# EAGLE design MyPulseSensorTH (EAGLE 6.5.0)
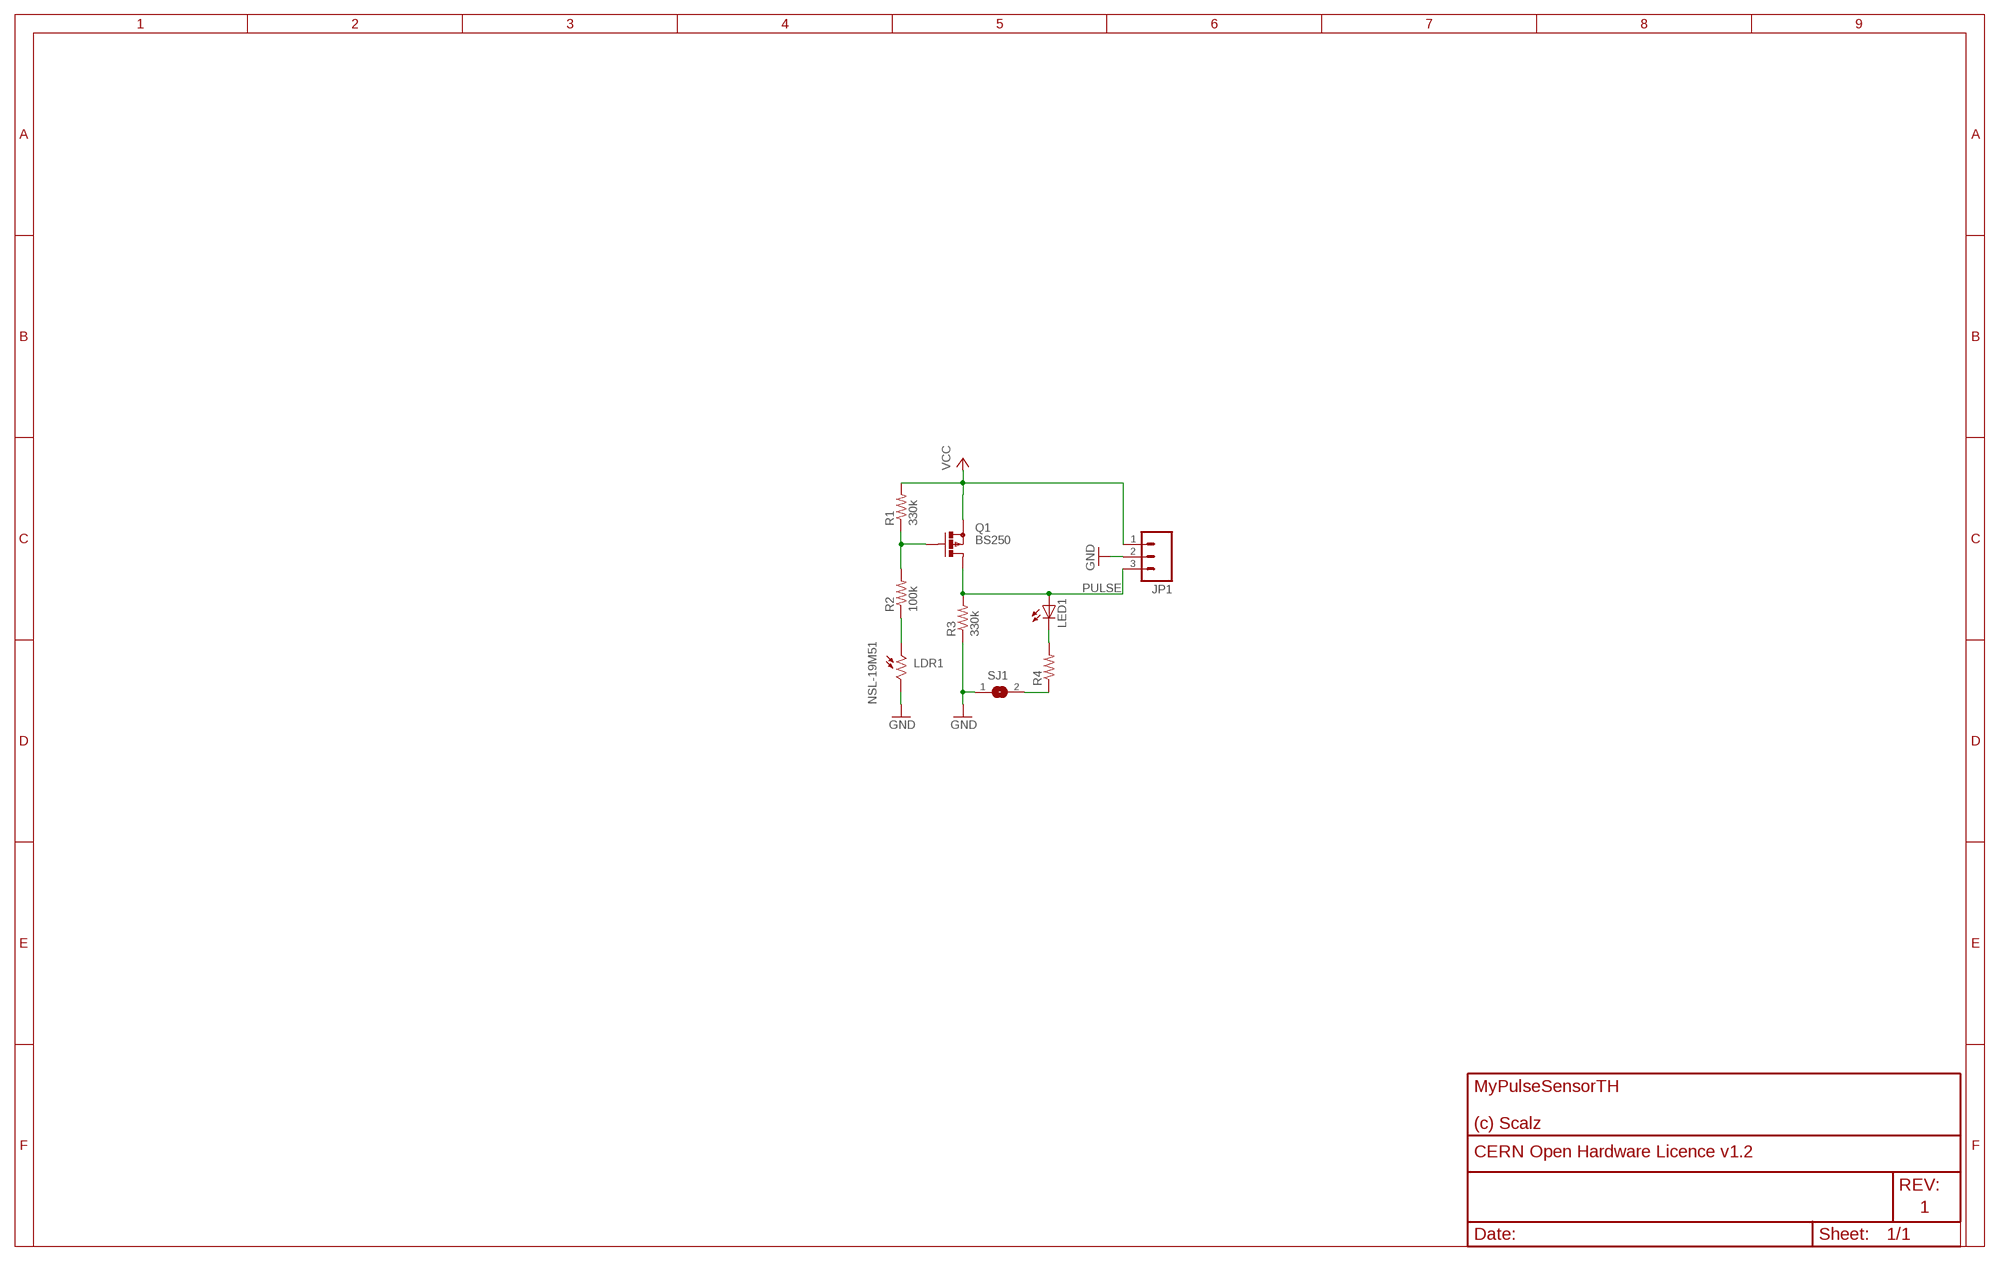
[diagram p0: schematic, sheet 1]

## Parts
JP1  M03PTH  [1X03]
LDR1  NSL-19M51  [PHOTORESISTOR_TO18]
LED1  LED5MM  [LED5MM]
Q1  BS250  [SOT54E]
R1  330k  RESISTOR  [RESISTOR_TH]
R2  100k  RESISTOR  [RESISTOR_TH]
R3  330k  RESISTOR  [RESISTOR_TH]
R4  RESISTOR  [RESISTOR_TH]
SJ1  SJ  [SJ]

## Nets
GND: JP1.2 LDR1.2 R3.1 SJ1.1
N$1: Q1.G R1.1 R2.2
N$2: LDR1.1 R2.1
N$3: LED1.K(C) R4.2
N$4: R4.1 SJ1.2
PULSE: JP1.3 LED1.A Q1.D R3.2
VCC: JP1.1 Q1.S R1.2

## Library data of the parts
JP1 = SparkFun-Connectors:M03: Header 3 Standard 3-pin 0.1" header. Use with straight break away headers (SKU : PRT-00116), right angle break away headers (PRT-00553), swiss pins (PRT-00743), machine pins (PRT-00117), and female headers (PRT-00115). Molex polarized connector foot print use with SKU : PRT-08232 with associated crimp pins and housings.
LDR1 = pulsesensor:NSL-19M51
LED1 = adafruit:LED: LED OSRAM: - CHIPLED LG R971, LG N971, LY N971, LG Q971, LY Q971, LO R971, LY R971 LH N974, LH R974 LS Q976, LO Q976, LY Q976 LO Q996 - Hyper CHIPLED LW Q18S LB Q993, LB Q99A, LB R99A - SideLED LS A670, LO A670, LY A670, LG A670, LP A670 LB A673, LV A673, LT A673, LW A673 LH A674 LY A675 LS A676, LA A676, LO A676, LY A676, LW A676 LS A679, LY A679, LG A679 - Hyper Micro SIDELED® LS Y876, LA Y876, LO Y876, LY Y876 LT Y87S - SmartLED LW L88C, LW L88S LB L89C, LB L89S, LG L890 LS L89K, LO L89K, LY L89K LS L896, LA L896, LO L896, LY L896 - TOPLED LS T670, LO T670, LY T670, LG T670, LP T670 LSG T670, LSP T670, LSY T670, LOP T670, LYG T670 LG T671, LOG T671, LSG T671 LB T673, LV T673, LT T673, LW T673 LH T674 LS T676, LA T676, LO T676, LY T676, LB T676, LH T676, LSB T676, LW T676 LB T67C, LV T67C, LT T67C, LS T67K, LO T67K, LY T67K, LW E67C LS E67B, LA E67B, LO E67B, LY E67B, LB E67C, LV E67C, LT E67C LW T67C LS T679, LY T679, LG T679 LS T770, LO T770, LY T770, LG T770, LP T770 LB T773, LV T773, LT T773, LW T773 LH T774 LS E675, LA E675, LY E675, LS T675 LS T776, LA T776, LO T776, LY T776, LB T776 LHGB T686 LT T68C, LB T68C - Hyper Mini TOPLED® LB M676 - Mini TOPLED Santana® LG M470 LS M47K, LO M47K, LY M47K Source: http://www.osram.convergy.de/
Q1 = transistor-small-signal:BS250: P-CHANNEL MOS FET
R1-R4 = pulsesensor:RESISTOR
SJ1 = jumper:SJ: SMD solder JUMPER

## Board
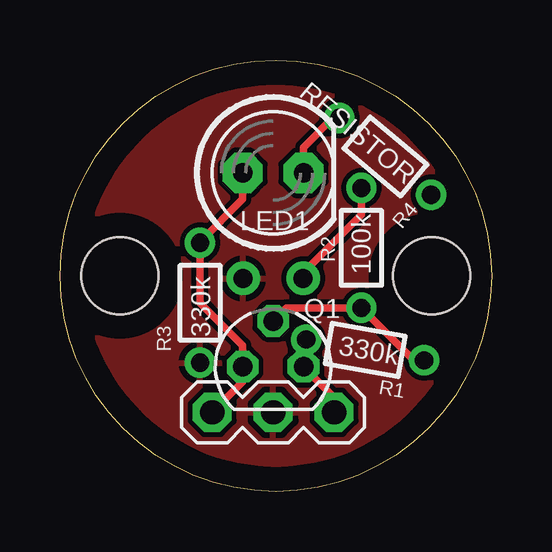
[diagram p1: board, top side]
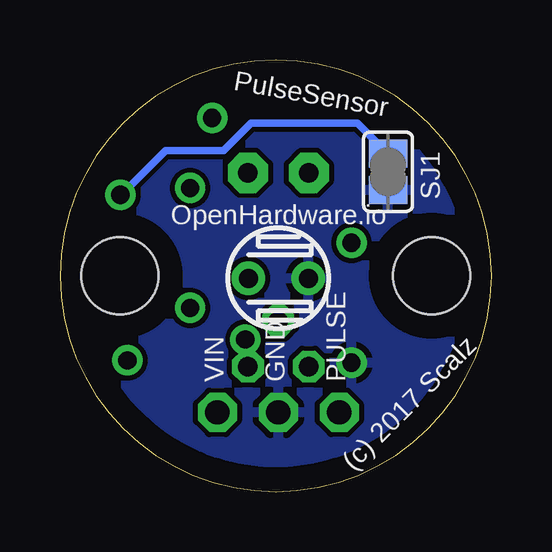
[diagram p2: board, bottom side, seen from below]

Size 18 x 18 mm. Coordinates in mm from the lower left corner, seen from the top.
Outline: 9,0 arc-180 9,18 arc-180 9,0
Copper layers (1*16): Top 0.035mm / dielectric 1.5mm / Bottom 0.035mm
Design rules "default": minimum track width 10mil, minimum drill 24mil, track to track 8mil, track to pad 8mil, pad to pad 8mil, via to via 8mil, smd to smd 8mil, copper to edge 40mil, drill to drill 8mil, minimum pad ring 10mil, minimum via ring 8mil, stop-mask expansion 4mil, vias tented up to drill 0mil, thermal gap 10mil
Holes 3.2 mm at 2.5,9 15.5,9

### Footprints (pad centres in the part's own frame; a part is rotated, then mirrored left to right if it is on the bottom)
1X03 = drill 1.016 pad 1.626 octagon: 1 0,0; 2 2.54,0; 3 5.08,0
PHOTORESISTOR_TO18 = drill 0.8 pad 1.4: 1 -1.25,0; 2 1.25,0
LED5MM = drill 0.813 pad 1.676 octagon: A -1.27,0; K 1.27,0
SOT54E = drill 0.813 octagon: D -1.27,0; G 0,1.905; S 1.27,0
RESISTOR_TH = drill 0.762: 1 -2.5,0; 2 2.5,0
SJ = smd 1.168 x 1.6: 1 -0.762,0; 2 0.762,0

### Placement (x,y rotation side)
JP1  11.43,3.3 180 top
LDR1  8.89,8.89 0 bottom
LED1  8.89,13.29 0 top
Q1  8.89,5.21 0 top
R1  12.73,5.91 170 top
R2  12.57,10.16 270 top
R3  5.84,7.87 90 top
R4  13.57,13.98 140 top
SJ1  4.32,13.34 90 bottom

### Tracks (layer width: path | path; a pad name or v marks a point on that pad's centre or on a via)
GND
  pour Top: -2.54,19.05 20.32,19.05 20.32,-1.27 -2.54,-1.27
  pour Bottom: -5.08,20.32 21.59,20.32 21.59,-5.08 -5.08,-5.08
N$1
  Top 0.305: Q1.G 9.44,7.66 R2.2 14.76,5.47 R1.1
N$2
  Top 0.305: LDR1.1 10.14,9.12 12.57,11.56 R2.1
N$3
  Top 0.305: R4.2 11.39,15.58 10.16,14.35 LED1.K
N$4
  Bottom 0.305: R4.1 15.44,12.37 13.59,14.22 11.18,14.22 10.03,15.37 5.59,15.37 SJ1.2
PULSE
  Top 0.305: JP1.3 7.62,4.57 Q1.D 7.62,6.1 6.1,7.62 5.84,7.87 R3.2 5.84,10.41 7.62,12.19 LED1.A
VCC
  Top 0.305: JP1.1 11.43,3.94 Q1.S 10.16,6.24 R1.2

### Text on the board
bPlace: PulseSensor | OpenHardware.io | PULSE | GND | VIN | (c) 2017 Scalz